# Altium schematic sheet 1_Controller.schdoc
size 309 x 223 mm; Symbol: Sheet-Symbol_A4; Device: Sheet-Symbol_A4; Company: EasyEDA.com; Drawed: EasyEDA Pro; Reviewed: EasyEDA Pro; Version: V0.1; Page Size: A4; @Project Name: Robomama_ver000; @Page Count: 5; @Update Date: 2024-01-29; @Create Date: 2023-12-28; @Schematic Name: Robomama_Schematic; Part Number: JLCPCB-002; @Page No: 1; @Page Name: Controller
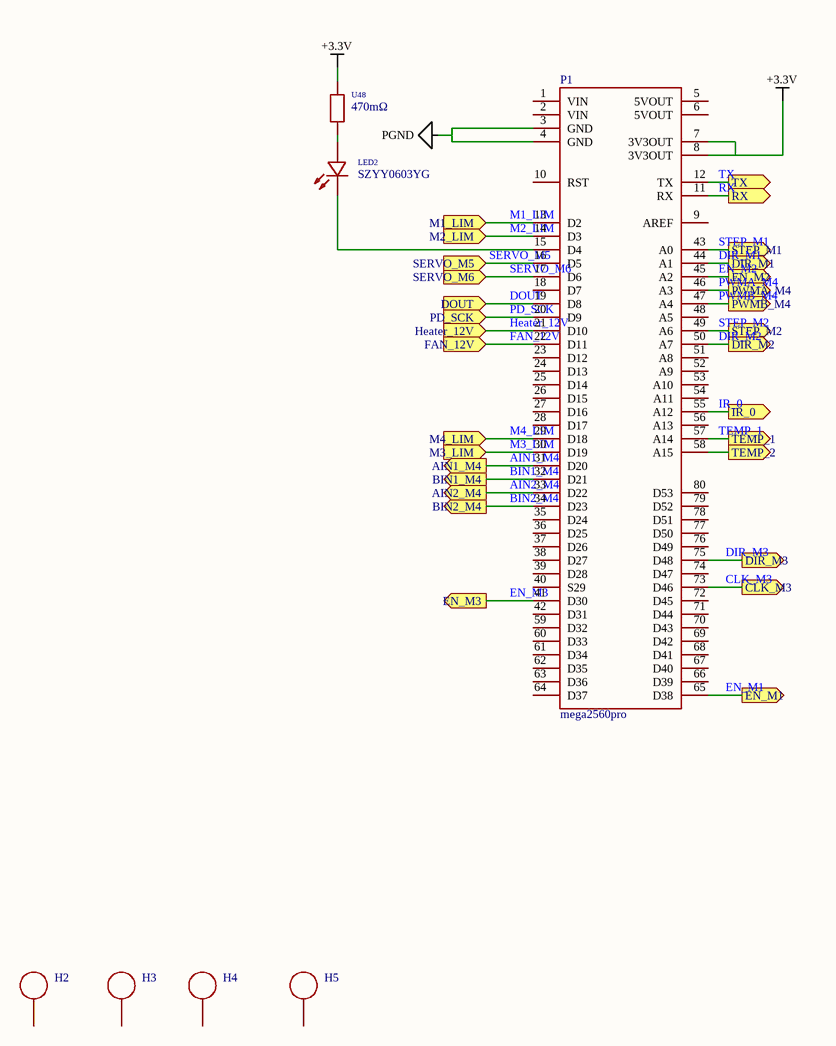
[diagram p0: 1_Controller.schdoc]

## Parts
H2  HOLE_D3M5_D7M0_PAD_PTH  [HOLE_D3M5_D7M0_PAD_PTH]  (value not drawn)
H3  HOLE_D3M5_D7M0_PAD_PTH  [HOLE_D3M5_D7M0_PAD_PTH]  (value not drawn)
H4  HOLE_D3M5_D7M0_PAD_PTH  [HOLE_D3M5_D7M0_PAD_PTH]  (value not drawn)
H5  HOLE_D3M5_D7M0_PAD_PTH  [HOLE_D3M5_D7M0_PAD_PTH]  (value not drawn)
LED2  SZYY0603YG  [LED0603-R-RD_GREEN]  (value not drawn)
P1  mega2560pro  [MEGA2560PRO]  (value not drawn)
U48  470mΩ  [R0603]  (value not drawn)

## Ports
AIN1_M4 (out), AIN2_M4 (out), BIN1_M4 (out), BIN2_M4 (out), CLK_M3 (out), DIR_M1 (out), DIR_M2 (out), DIR_M3 (out), DOUT (in), EN_M1 (out), EN_M2 (out), EN_M3 (out), FAN_12V (in), Heater_12V (in), IR_0 (out), M1_LIM (in), M2_LIM (in), M3_LIM (in), M4_LIM (in), PD_SCK (in), PWMA_M4 (out), PWMB_M4 (out), RX (out), SERVO_M5 (in), SERVO_M6 (in), STEP_M1 (out), STEP_M2 (out), TEMP_1 (out), TEMP_2 (out), TX (out)

## Nets
+3.3V: P1.7(3V3OUT) P1.8(3V3OUT) U48.2
PGND: P1.3(GND) P1.4(GND)
AIN1_M4: P1.31(D20) ; port AIN1_M4
AIN2_M4: P1.33(D22) ; port AIN2_M4
BIN1_M4: P1.32(D21) ; port BIN1_M4
BIN2_M4: P1.34(D23) ; port BIN2_M4
CLK_M3: P1.73(D46) ; port CLK_M3
DIR_M1: P1.44(A1) ; port DIR_M1
DIR_M2: P1.50(A7) ; port DIR_M2
DIR_M3: P1.75(D48) ; port DIR_M3
DOUT: P1.19(D8) ; port DOUT
EN_M1: P1.65(D38) ; port EN_M1
EN_M2: P1.45(A2) ; port EN_M2
EN_M3: P1.41(D30) ; port EN_M3
FAN_12V: P1.22(D11) ; port FAN_12V
Heater_12V: P1.21(D10) ; port Heater_12V
IR_0: P1.55(A12) ; port IR_0
M1_LIM: P1.13(D2) ; port M1_LIM
M2_LIM: P1.14(D3) ; port M2_LIM
M3_LIM: P1.30(D19) ; port M3_LIM
M4_LIM: P1.29(D18) ; port M4_LIM
PD_SCK: P1.20(D9) ; port PD_SCK
PWMA_M4: P1.46(A3) ; port PWMA_M4
PWMB_M4: P1.47(A4) ; port PWMB_M4
RX: P1.11(RX) ; port RX
SERVO_M5: P1.16(D5) ; port SERVO_M5
SERVO_M6: P1.17(D6) ; port SERVO_M6
STEP_M1: P1.43(A0) ; port STEP_M1
STEP_M2: P1.49(A6) ; port STEP_M2
TEMP_1: P1.57(A14) ; port TEMP_1
TEMP_2: P1.58(A15) ; port TEMP_2
TX: P1.12(TX) ; port TX
NetLED2_1: LED2.1(+) U48.1
NetLED2_2: LED2.2(-) P1.15(D4)

Not connected (* = marked no-connect by the designer): H2 1; H3 1; H4 1; H5 1; P1 1(VIN) 2(VIN) 5(5VOUT) 6(5VOUT) 9(AREF) 10(RST) 18(D7) 23(D12) 24(D13) 25(D14) 26(D15) 27(D16) 28(D17) 35(D24) 36(D25) 37(D26) 38(D27) 39(D28) 40(S29) 42(D31) 48(A5) 51(A8) 52(A9) 53(A10) 54(A11) 56(A13) 59(D32) 60(D33) 61(D34) 62(D35) 63(D36) 64(D37) 66(D39) 67(D40) 68(D41) 69(D42) 70(D43) 71(D44) 72(D45) 74(D47) 76(D49) 77(D50) 78(D51) 79(D52) 80(D53)

## Notes on the sheet
- 1
- 2
- 3
- 4
- 5
- 6
- A
- B
- C
- Schematic
- Robomama_Schematic
- Create Date
- Update Date
- 2024-01-29
- 2023-12-28
- Reviewed
- Drawed
- Page
- EasyEDA Pro
- Controller
- Part Number
- Robomama_ver000
- JLCPCB-002
- D
- VER
- SIZE
- PAGE
- OF
- V0.1
- A4
- EasyEDA.com

## Library data of the parts
H2-H5 = HOLE_D3M5_D7M0_PAD_PTH: 3.5mm diameter plated M3 clearance hole with 7mm diameter pad around it to clear nuts and washers. The symbol has a pin to connect this pad to a net if required. Place a Not Connected &apos;X&apos; on the pin if the hole is to be isolated.; Add into BOM: no; Convert to PCB: yes; Symbol: HOLE_D3M5_D7M0_PAD_PTH; Device: HOLE_D3M5_D7M0_PAD_PTH
LED2 = SZYY0603YG: Emitted Color:Green-yellow; Manufacturer: yongyu(永裕光电); Add into BOM: yes; Symbol: SZYY0603YG; Device: SZYY0603YG; Supplier: LCSC; Supplier Part: C434423; Manufacturer Part: SZYY0603YG; JLCPCB Part Class: Extended Part; LCSC Part Name: 普绿/黄绿; Supplier Footprint: 0603; Datasheet: https://atta.szlcsc.com/upload/public/pdf/source/20191204/C434423_A1540F327AC0495CFC4F5F4A5CB9D8CC.pdf; Convert to PCB: yes; Emitted Color: Green-yellow
P1 = MEGA2560PRO: Add into BOM: yes; Symbol: MEGA2560PRO; Device: MEGA2560PRO; Convert to PCB: yes; Description: mega2560pro
U48 = FRL0603FR470TS: Resistance: Tolerance:±1% Tolerance:±1% Power(Watts): Overload Voltage (Max): Temperature Coefficient:±300ppm/℃ Temperature Coefficient:±300ppm/℃ Type:Thick Film Resistors; Manufacturer: FOJAN(富捷); Add into BOM: yes; Tolerance: ±1%; Symbol: FRL0603FR470TS; Device: FRL0603FR470TS; Supplier: LCSC; Supplier Part: C3013349; Manufacturer Part: FRL0603FR470TS; Value: 470mΩ; JLCPCB Part Class: Extended Part; LCSC Part Name: 470mΩ ±1% 100mW 厚膜电阻; Supplier Footprint: 0603; Datasheet: https://atta.szlcsc.com/upload/public/pdf/source/20211221/925EC7D7225764EE0046F22065062C87.pdf; Convert to PCB: yes; Temperature Coefficient: ±300ppm/℃; Type: Thick Film Resistors